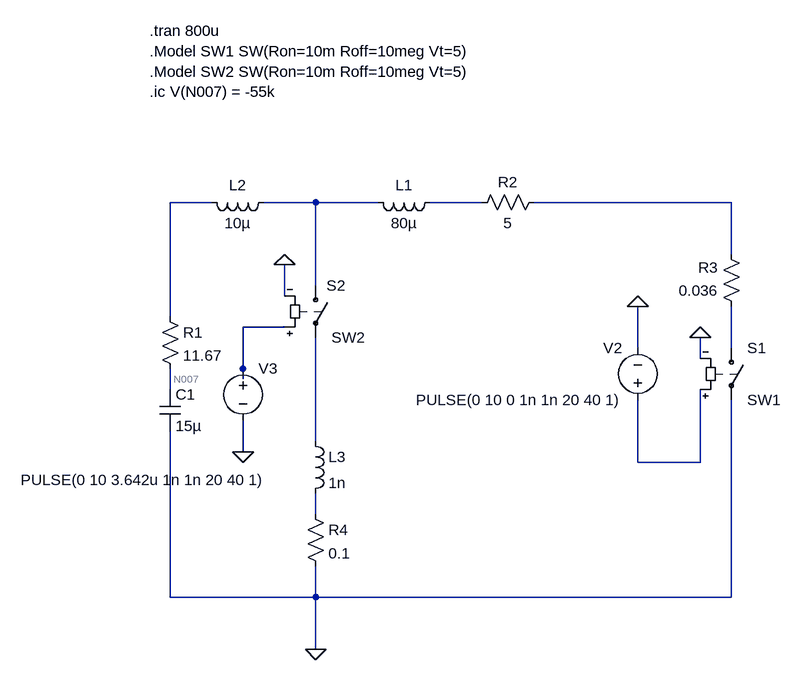
[diagram p0: schematic CrowbarD4EFat50kV.asc]
CrowbarD4EFat50kV.asc, the LTspice schematic file:
Version 4
SHEET 1 1688 680
WIRE 800 -112 736 -112
WIRE 960 -112 880 -112
WIRE 1056 -112 960 -112
WIRE 1216 -112 1136 -112
WIRE 1600 -112 1296 -112
WIRE 1600 -32 1600 -112
WIRE 960 16 960 -112
WIRE 912 32 912 -16
WIRE 736 64 736 -112
WIRE 912 80 848 80
WIRE 1456 112 1456 48
WIRE 1600 112 1600 48
WIRE 1552 128 1552 96
WIRE 848 144 848 80
WIRE 848 160 848 144
WIRE 736 176 736 144
WIRE 960 256 960 96
WIRE 848 272 848 224
WIRE 1456 288 1456 192
WIRE 1552 288 1552 176
WIRE 1552 288 1456 288
WIRE 960 368 960 336
WIRE 736 496 736 240
WIRE 960 496 960 448
WIRE 960 496 736 496
WIRE 1600 496 1600 192
WIRE 1600 496 960 496
WIRE 960 576 960 496
FLAG 960 576 0
FLAG 1456 48 0
FLAG 1552 96 0
FLAG 912 -16 0
FLAG 848 272 0
SYMBOL res 720 48 R0
SYMATTR InstName R1
SYMATTR Value 11.67
SYMBOL res 1312 -128 R90
WINDOW 0 0 56 VBottom 2
WINDOW 3 32 56 VTop 2
SYMATTR InstName R2
SYMATTR Value 5
SYMBOL ind 1152 -128 R90
WINDOW 0 5 56 VBottom 2
WINDOW 3 32 56 VTop 2
SYMATTR InstName L1
SYMATTR Value 80µ
SYMBOL cap 720 176 R0
SYMATTR InstName C1
SYMATTR Value 15µ
SYMBOL sw 1600 96 R0
SYMATTR InstName S1
SYMATTR Value SW1
SYMBOL voltage 1456 208 R180
WINDOW 0 24 96 Left 2
WINDOW 3 24 16 Left 2
SYMATTR InstName V2
SYMATTR Value PULSE(0 10 0 1n 1n 20 40 1)
SYMBOL res 1616 64 R180
WINDOW 0 36 76 Left 2
WINDOW 3 36 40 Left 2
SYMATTR InstName R3
SYMATTR Value 0.036
SYMBOL sw 960 0 R0
WINDOW 0 17 16 Left 2
SYMATTR InstName S2
SYMATTR Value SW2
SYMBOL voltage 848 128 R0
WINDOW 3 -342 187 Left 2
SYMATTR InstName V3
SYMATTR Value PULSE(0 10 3.642u 1n 1n 20 40 1)
SYMBOL res 944 352 R0
SYMATTR InstName R4
SYMATTR Value 0.1
SYMBOL ind 896 -128 R90
WINDOW 0 5 56 VBottom 2
WINDOW 3 32 56 VTop 2
SYMATTR InstName L2
SYMATTR Value 10µ
SYMBOL ind 944 240 R0
SYMATTR InstName L3
SYMATTR Value 1n
TEXT 704 -376 Left 2 !.tran 800u\n.Model SW1 SW(Ron=10m Roff=10meg Vt=5)\n.Model SW2 SW(Ron=10m Roff=10meg Vt=5)\n.ic V(N007) = -55k

The netlist it stands for:
* CrowbarD4EFat50kV.asc
R1 N001 N007 11.67
R2 N004 N003 5
L1 N003 N002 80µ
C1 N007 0 15µ
S1 N006 0 N009 0 SW1
V2 N009 0 PULSE(0 10 0 1n 1n 20 40 1)
R3 N006 N004 0.036
S2 N002 N008 N005 0 SW2
V3 N005 0 PULSE(0 10 3.642u 1n 1n 20 40 1)
R4 N010 0 0.1
L2 N002 N001 10µ
L3 N008 N010 1n
.tran 800u
.Model SW1 SW(Ron=10m Roff=10meg Vt=5)
.Model SW2 SW(Ron=10m Roff=10meg Vt=5)
.ic V(N007) = -55k
.backanno
.end